# EAGLE design microcontroller-board (EAGLE 5.06)
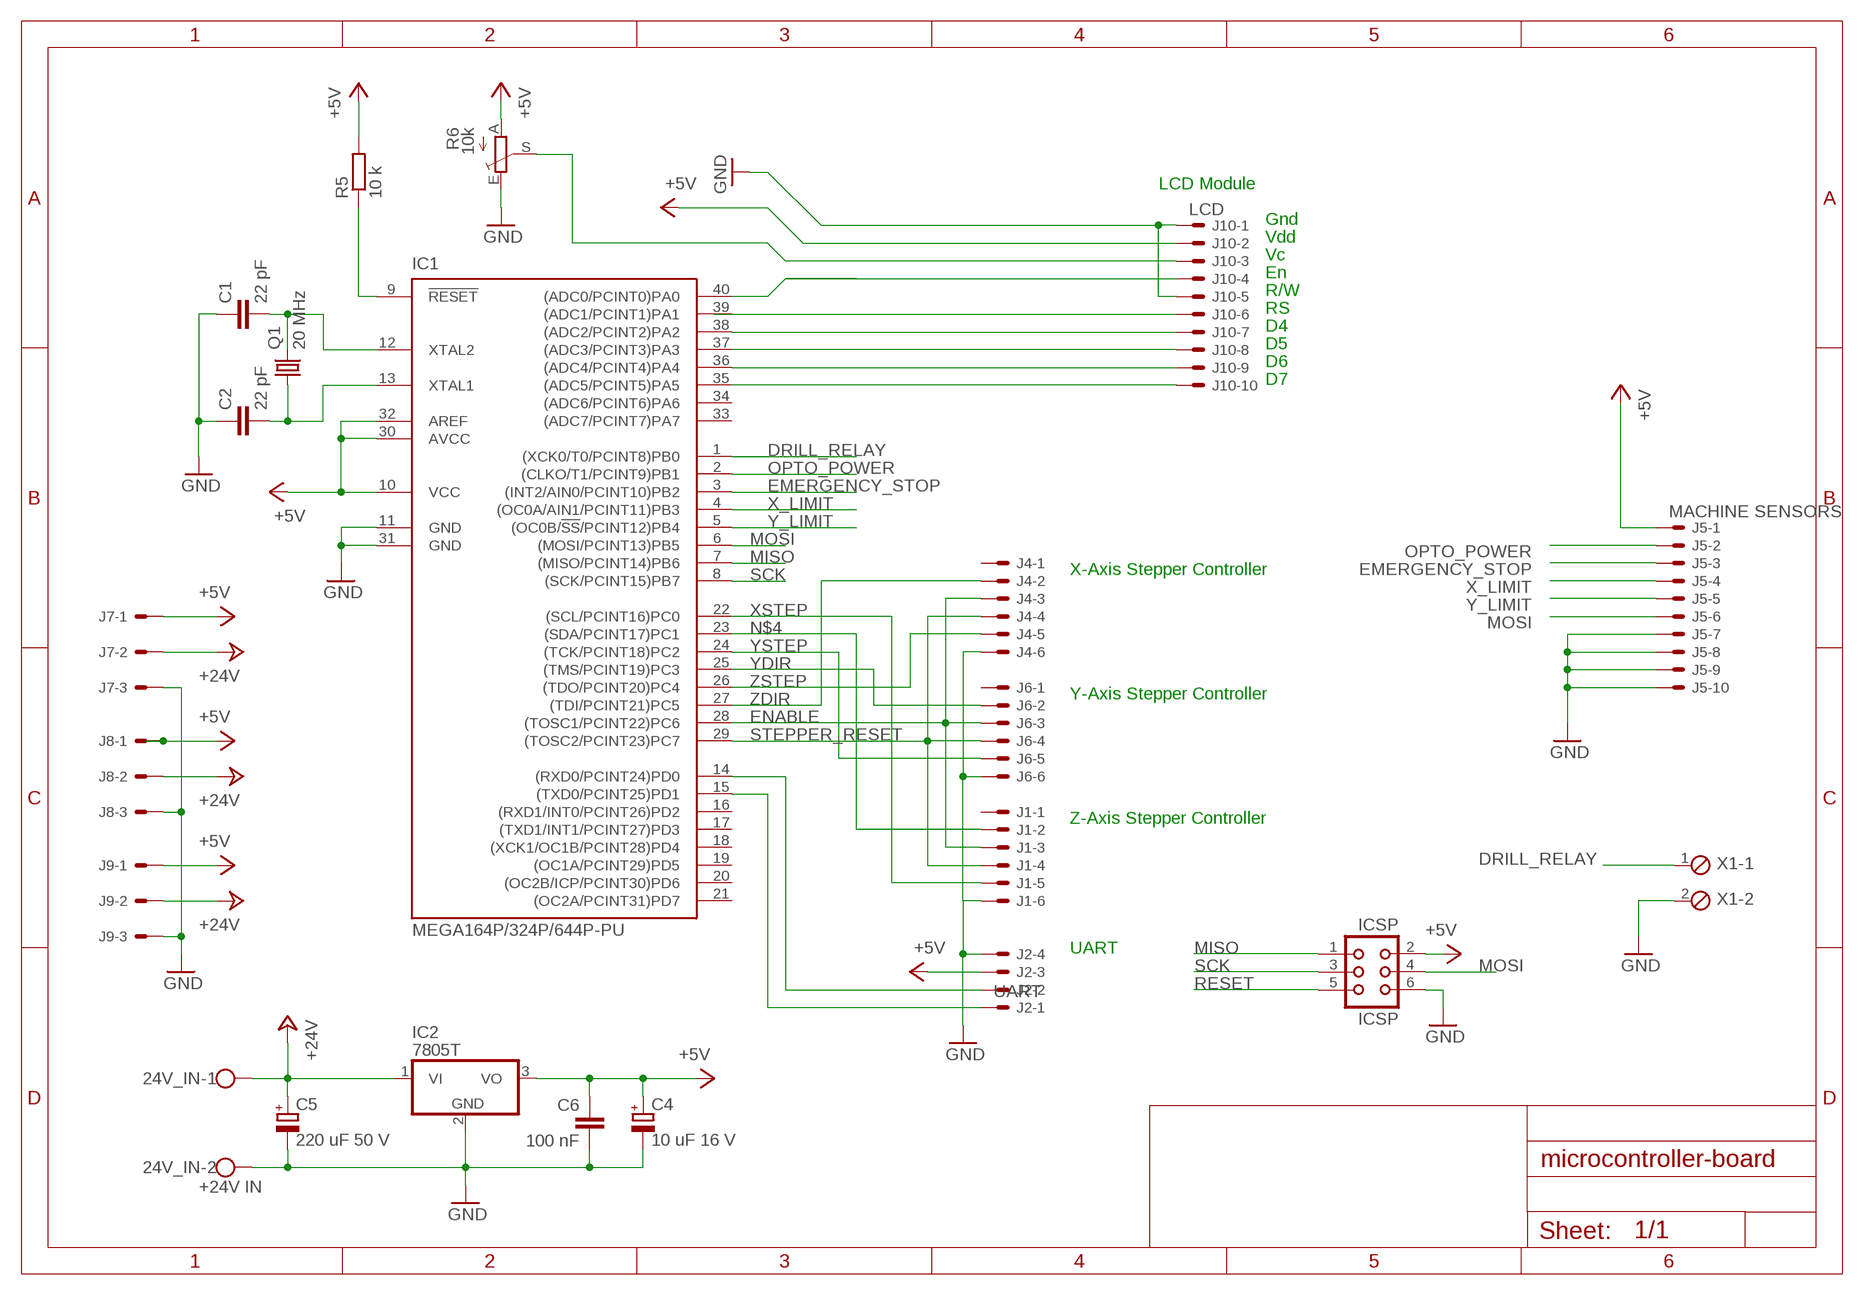
[diagram p0: schematic, sheet 1]

## Parts
24V_IN  +24V IN  W237-02P  [W237-132]
C1  22 pF  C-EU050-024X044  [C050-024X044]
C2  22 pF  C-EU050-024X044  [C050-024X044]
C4  10 uF 16 V  CPOL-EUE5-5  [E5-5]
C5  220 uF 50 V  CPOL-EUE5-8.5  [E5-8,5]
C6  100 nF  C-EU050-024X044  [C050-024X044]
IC1  MEGA164P/324P/644P-PU  [DIL40]
IC2  7805T  [TO220H]
ICSP  ICSP  CON06  [CON06]
J1  22-27-2061-06  [6410-06]
J2  UART  22-27-2041-04  [6410-04]
J4  22-27-2061-06  [6410-06]
J5  MACHINE SENSORS  22-27-2101-10  [6410-10]
J6  22-27-2061-06  [6410-06]
J7  22-27-2031-03  [6410-03]
J8  22-27-2031-03  [6410-03]
J9  22-27-2031-03  [6410-03]
J10  LCD  22-27-2101-10  [6410-10]
Q1  20 MHz  CRYSTALHC49U-V  [HC49U-V]
R5  10 k  R-EU_0207/10  [0207/10]
R6  10k  TRIM_EU-RS3  [RS3]
X1  MPT2  [2POL254]

## Nets
+5V: C4.+ C6.1 IC1.10(VCC) IC1.30(AVCC) IC1.32(AREF) IC2.3(VO) ICSP.2 J2.3 J5.1 J7.1 J8.1 J9.1 J10.2 R5.2 R6.A
+24V: 24V_IN.1 C5.+ IC2.1(VI) J7.2 J8.2 J9.2
DRILL_RELAY: IC1.1((XCK0/T0/PCINT8)PB0) X1.1
EMERGENCY_STOP: IC1.3((INT2/AIN0/PCINT10)PB2) J5.3
ENABLE: IC1.28((TOSC1/PCINT22)PC6) J1.3 J4.3 J6.3
GND: 24V_IN.2 C1.1 C2.1 C4.- C5.- C6.2 IC1.11(GND) IC1.31(GND) IC2.2(GND) ICSP.6 J1.6 J2.4 J4.6 J5.7 J5.8 J5.9 J5.10 J6.6 J7.3 J8.3 J9.3 J10.1 J10.5 R6.E X1.2
MISO: IC1.7((MISO/PCINT14)PB6) ICSP.1
MOSI: IC1.6((MOSI/PCINT13)PB5) ICSP.4 J5.6
N$1: C1.2 IC1.12(XTAL2) Q1.2
N$2: C2.2 IC1.13(XTAL1) Q1.1
N$4: IC1.23((SDA/PCINT17)PC1) J1.2
N$5: IC1.39((ADC1/PCINT1)PA1) J10.6
N$6: IC1.35((ADC5/PCINT5)PA5) J10.10
N$7: J10.3 R6.S
N$12: IC1.36((ADC4/PCINT4)PA4) J10.9
N$13: IC1.37((ADC3/PCINT3)PA3) J10.8
N$14: IC1.38((ADC2/PCINT2)PA2) J10.7
N$17: IC1.15((TXD0/PCINT25)PD1) J2.1
N$18: IC1.14((RXD0/PCINT24)PD0) J2.2
N$31: IC1.40((ADC0/PCINT0)PA0) J10.4
OPTO_POWER: IC1.2((CLKO/T1/PCINT9)PB1) J5.2
RESET: IC1.9(!RESET) ICSP.5 R5.1
SCK: IC1.8((SCK/PCINT15)PB7) ICSP.3
STEPPER_RESET: IC1.29((TOSC2/PCINT23)PC7) J1.4 J4.4 J6.4
X_LIMIT: IC1.4((OC0A/AIN1/PCINT11)PB3) J5.4
XSTEP: IC1.22((SCL/PCINT16)PC0) J1.5
Y_LIMIT: IC1.5((OC0B/!SS!/PCINT12)PB4) J5.5
YDIR: IC1.25((TMS/PCINT19)PC3) J6.2
YSTEP: IC1.24((TCK/PCINT18)PC2) J6.5
ZDIR: IC1.27((TDI/PCINT21)PC5) J4.2
ZSTEP: IC1.26((TDO/PCINT20)PC4) J4.5
Unconnected: IC1.16((RXD1/INT0/PCINT26)PD2) IC1.17((TXD1/INT1/PCINT27)PD3) IC1.18((XCK1/OC1B/PCINT28)PD4) IC1.19((OC1A/PCINT29)PD5) IC1.20((OC2B/ICP/PCINT30)PD6) IC1.21((OC2A/PCINT31)PD7) IC1.33((ADC7/PCINT7)PA7) IC1.34((ADC6/PCINT6)PA6) J1.1 J4.1 J6.1

## Notes on the sheet
- LCD Module
- Gnd
- Vdd
- Vc
- En
- R/W
- RS
- D4
- D5
- D6
- D7
- X-Axis Stepper Controller
- Y-Axis Stepper Controller
- Z-Axis Stepper Controller
- UART

## Library data of the parts
24V_IN = con-wago-508:W237-02P: WAGO SREW CLAMP
C1 C2 C6 = rcl:C-EU: CAPACITOR, European symbol
C4 C5 = rcl:CPOL-EU: POLARIZED CAPACITOR, European symbol
IC1 = avr-5:MEGA164P/324P/644P-PU
IC2 = linear:78*: Positive VOLTAGE REGULATOR Source: http://cache.national.com/ds/LM/LM78L05.pdf http://www.fairchildsemi.com/ds/LM/LM7805.pdf
ICSP = con-harting:CON06: CONNECTOR
J1 J4 J6 = con-molex:22-?-06: CONNECTOR wire to board 2.54 mm (.1 inch) pitch header
J2 = con-molex:22-?-04: CONNECTOR wire to board 2.54 mm (.1 inch) pitch header
J5 J10 = con-molex:22-?-10: CONNECTOR wire to board 2.54 mm (.1 inch) pitch header
J7-J9 = con-molex:22-?-03: CONNECTOR wire to board 2.54 mm (.1 inch) pitch header
Q1 = crystal:CRYSTAL: CRYSTAL
R5 = rcl:R-EU_: RESISTOR, European symbol
R6 = pot:TRIM_EU-: POTENTIOMETER
X1 = con-phoenix-254:MPT2: PHOENIX CONNECTOR

## Board
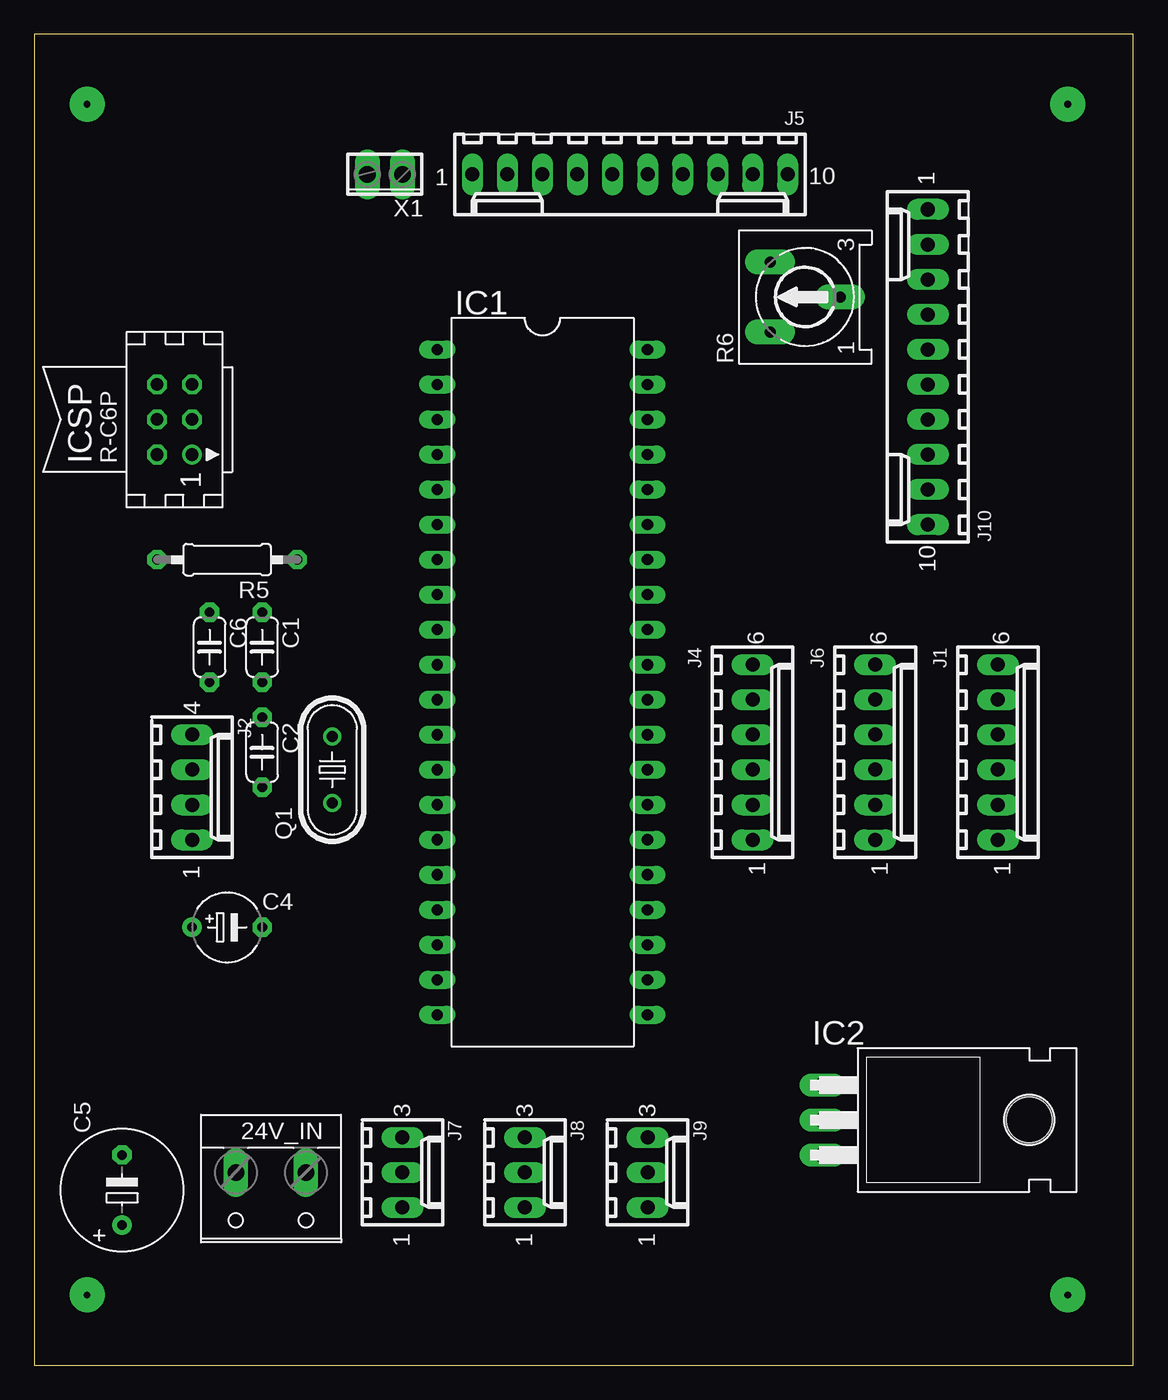
[diagram p1: board, top side]
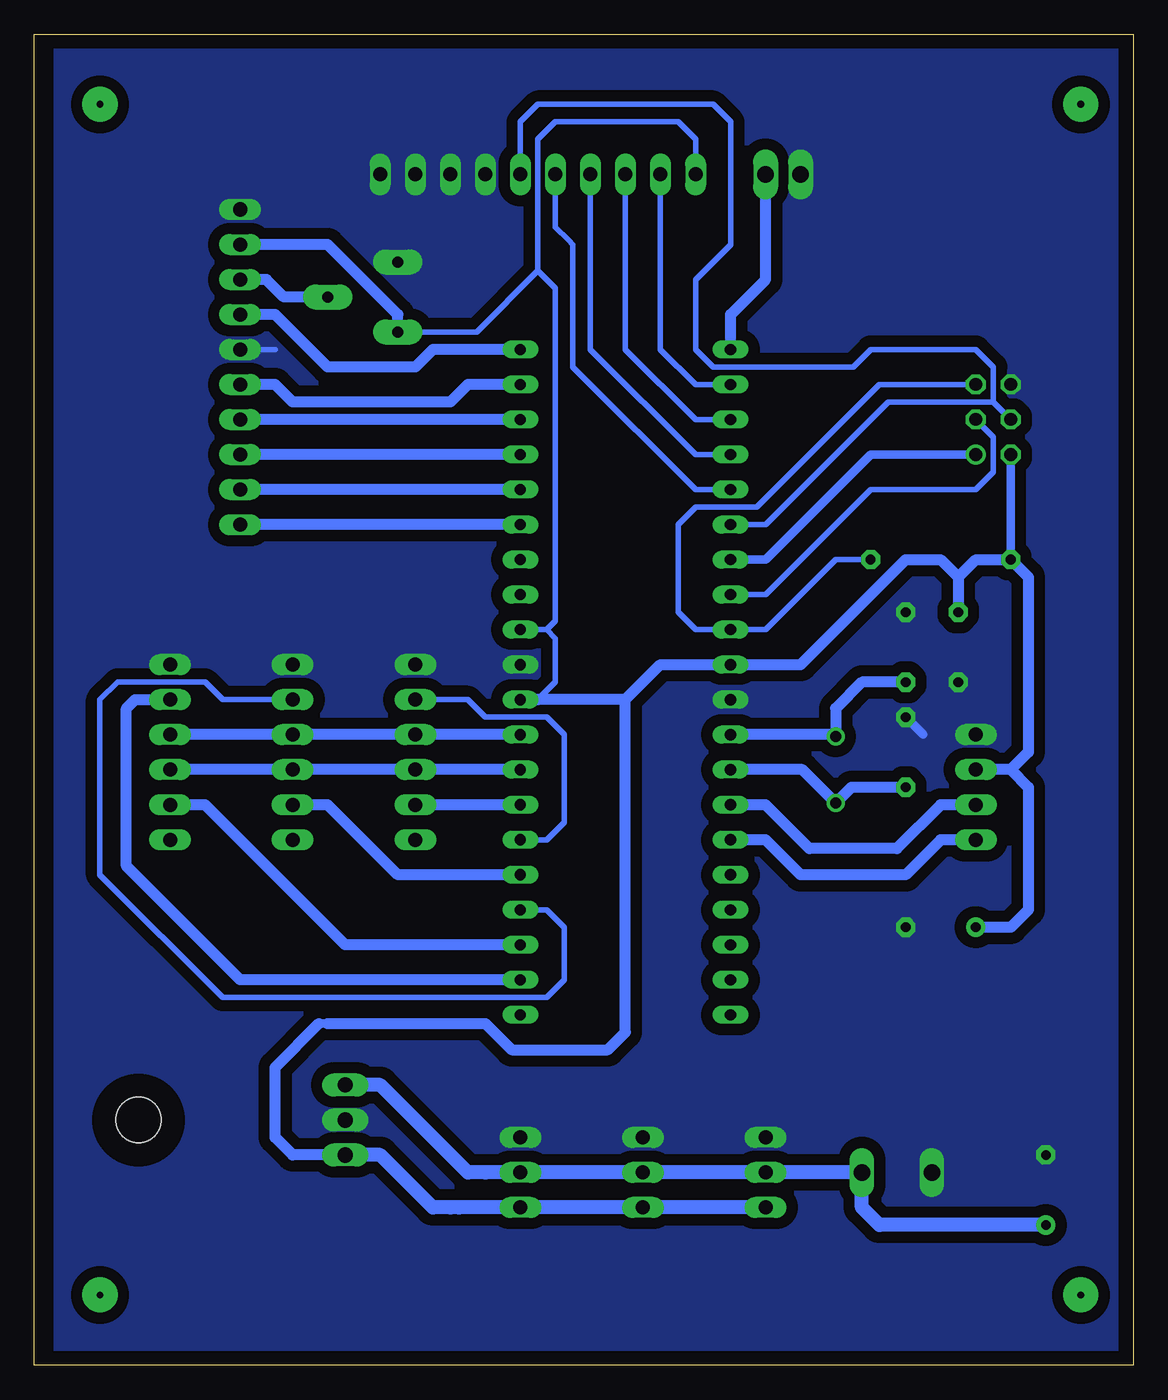
[diagram p2: board, bottom side, seen from below]

Size 79.68 x 96.51 mm. Coordinates in mm from the lower left corner, seen from the top.
Outline: 0,0 79.68,0 79.68,96.51 0,96.51 0,0
Copper layers (1*16): Top 0.035mm / dielectric 1.5mm / Bottom 0.035mm
Design rules "default": minimum track width 10mil, minimum drill 24mil, track to track 8mil, track to pad 8mil, pad to pad 8mil, via to via 8mil, smd to smd 8mil, copper to edge 40mil, drill to drill 8mil, minimum pad ring 10mil, minimum via ring 8mil, stop-mask expansion 4mil, vias tented up to drill 0mil, thermal gap 10mil

### Footprints (pad centres in the part's own frame; a part is rotated, then mirrored left to right if it is on the bottom)
W237-132 = drill 1.194 long: 1 -2.54,-0.635; 2 2.54,-0.635
C050-024X044 = drill 0.7 pad 1.4 octagon: 1 -2.54,0; 2 2.54,0
E5-5 = drill 0.7 pad 1.4 round: + -2.54,0 | drill 0.7 pad 1.4 octagon: - 2.54,0
E5-8,5 = drill 0.7 pad 1.4 round: + -2.54,0 | drill 0.7 pad 1.4 octagon: - 2.54,0
DIL40 = drill 0.813 long: 1 -24.13,-7.62; 2 -21.59,-7.62; 3 -19.05,-7.62; 4 -16.51,-7.62; 5 -13.97,-7.62; 6 -11.43,-7.62; 7 -8.89,-7.62; 8 -6.35,-7.62; 9 -3.81,-7.62; 10 -1.27,-7.62; 11 1.27,-7.62; 12 3.81,-7.62; 13 6.35,-7.62; 14 8.89,-7.62; 15 11.43,-7.62; 16 13.97,-7.62; 17 16.51,-7.62; 18 19.05,-7.62; 19 21.59,-7.62; 20 24.13,-7.62; 21 24.13,7.62; 22 21.59,7.62; 23 19.05,7.62; 24 16.51,7.62; 25 13.97,7.62; 26 11.43,7.62; 27 8.89,7.62; 28 6.35,7.62; 29 3.81,7.62; 30 1.27,7.62; 31 -1.27,7.62; 32 -3.81,7.62; 33 -6.35,7.62; 34 -8.89,7.62; 35 -11.43,7.62; 36 -13.97,7.62; 37 -16.51,7.62; 38 -19.05,7.62; 39 -21.59,7.62; 40 -24.13,7.62
TO220H = drill 1.118 long: 1 -2.54,-10.16; 2 0,-10.16; 3 2.54,-10.16 | hole 3.302: 0,4.826
CON06 = drill 0.914 round: 1 -2.54,-1.27 | drill 0.914 octagon: 2 -2.54,1.27; 3 0,-1.27; 4 0,1.27; 5 2.54,-1.27; 6 2.54,1.27
6410-06 = drill 1.016 long: 1 6.35,0; 2 3.81,0; 3 1.27,0; 4 -1.27,0; 5 -3.81,0; 6 -6.35,0
6410-04 = drill 1.016 long: 1 3.81,0; 2 1.27,0; 3 -1.27,0; 4 -3.81,0
6410-10 = drill 1.016 long: 1 11.43,0; 2 8.89,0; 3 6.35,0; 4 3.81,0; 5 1.27,0; 6 -1.27,0; 7 -3.81,0; 8 -6.35,0; 9 -8.89,0; 10 -11.43,0
6410-03 = drill 1.016 long: 1 2.54,0; 2 0,0; 3 -2.54,0
HC49U-V = drill 0.813 round: 1 -2.413,0; 2 2.413,0
0207/10 = drill 0.7 pad 1.4 octagon: 1 -5.08,0; 2 5.08,0
RS3 = drill 0.8 pad 1.8 long: A -2.54,2.54; E 2.54,2.54; S 0,-2.54
2POL254 = drill 1.2 long: 1 -1.27,0; 2 1.27,0

### Placement (x,y rotation side)
24V_IN  17.14,13.34 180 top
C1  16.51,52.07 270 top
C2  16.51,44.45 270 top
C4  13.97,31.75 0 top
C5  6.35,12.7 90 top
C6  12.7,52.07 270 top
IC1  36.83,49.53 270 top
IC2  67.31,17.78 270 top
ICSP  10.16,68.58 90 top
J1  69.85,44.45 270 top
J2  11.43,41.91 270 top
J4  52.07,44.45 270 top
J5  43.18,86.36 180 top
J6  60.96,44.45 270 top
J7  26.67,13.97 270 top
J8  35.56,13.97 270 top
J9  44.45,13.97 270 top
J10  64.77,72.39 90 top
Q1  21.59,43.18 90 top
R5  13.97,58.42 180 top
R6  55.88,77.47 90 top
X1  25.4,86.36 180 top

### Tracks (layer width: path | path; a pad name or v marks a point on that pad's centre or on a via)
+5V
  Bottom 0.406: J5.1 31.75,88.9 33.02,90.17 41.91,90.17 43.18,88.9 43.18,79.38 | R6.A 47.62,74.93 43.18,79.38 | 43.18,79.38 41.91,78.1 41.91,66.67 | 41.91,66.67 41.91,66.04 | 42.55,53.34 41.91,53.97 41.91,66.67 | 42.55,53.34 IC1.32 | 42.55,53.34 41.91,52.7 41.91,49.53 43.18,48.26
  Bottom 0.61: J8.1 J9.1 | 59.05,24.77 58.42,24.77 | R5.2 ICSP.2
  Bottom 0.813: 8.89,43.18 7.62,44.45 7.62,57.15 R5.2 11.43,58.42 12.7,57.15 | 8.89,43.18 J2.3 | 36.83,48.26 43.18,48.26 IC1.30 | 36.83,48.26 36.83,24.13 38.1,22.86 45.09,22.86 46.99,24.77 58.42,24.77 | 36.83,48.26 34.29,50.8 IC1.10 24.13,50.8 16.51,58.42 13.97,58.42 12.7,57.15 | 59.05,24.77 62.23,21.59 62.23,16.51 60.96,15.24 IC2.3 | 12.7,57.15 C6.1 | C4.+ 8.89,31.75 7.62,33.02 7.62,41.91 8.89,43.18 | J10.2 58.42,81.28 53.34,76.2 R6.A
  Bottom 1.016: J7.1 J8.1 J9.1 48.89,11.43 | 48.89,11.43 49.53,11.43 | 48.89,11.43 50.8,11.43 54.61,15.24 IC2.3
+24V
  Bottom 0.813: J8.2 37.46,13.97
  Bottom 1.016: C5.+ 18.41,10.16 19.68,11.43 24V_IN.1 J7.2 J8.2 J9.2 46.99,13.97 48.26,13.97 54.61,20.32 IC2.1
DRILL_RELAY
  Bottom 0.813: X1.1 26.67,78.74 29.21,76.2 IC1.1
EMERGENCY_STOP
  Bottom 0.406: J5.3 36.83,73.66 31.75,68.58 IC1.3
ENABLE
  Bottom 0.813: IC1.28 J4.3 J6.3 J1.3
GND
  Bottom 0.406: 62.23,73.66 J10.5
  Bottom 0.61: 15.24,45.72 C2.1
  pour Bottom (isolate 0.813, no thermals): 78.11,0 1.27,0 1.27,97.16 78.11,97.16
MISO
  Bottom 0.61: ICSP.1 19.05,66.04 26.67,58.42 IC1.7
MOSI
  Bottom 0.406: ICSP.4 10.16,69.85 | IC1.6 26.67,60.96 17.78,69.85 10.16,69.85 | 10.16,69.85 10.16,72.39 11.43,73.66 19.05,73.66 20.32,72.39 30.48,72.39 31.75,73.66 31.75,78.74 29.21,81.28 29.21,90.17 30.48,91.44 43.18,91.44 44.45,90.17 J5.6
N$1
  Bottom 0.61: Q1.2 21.59,45.72
  Bottom 0.813: 21.59,45.72 IC1.12 | Q1.2 21.59,47.62 19.68,49.53 C1.2
N$2
  Bottom 0.813: IC1.13 24,43.18 Q1.1 20.45,41.91 C2.2
N$3  (via drill 0.5 pad 2.54)
  other vias: 74.93,91.44
N$4
  Bottom 0.813: IC1.23 57.15,30.48 67.31,40.64 J1.2
N$5
  Bottom 0.813: IC1.39 48.26,71.12 49.53,69.85 60.96,69.85 62.23,71.12 J10.6
N$6
  Bottom 0.813: IC1.35 J10.10
N$7
  Bottom 0.813: J10.3 62.86,78.74 61.59,77.47 R6.S
N$8  (via drill 0.5 pad 2.54)
  other vias: 3.81,91.44
N$9  (via drill 0.5 pad 2.54)
  other vias: 3.81,5.08
N$10  (via drill 0.5 pad 2.54)
  other vias: 74.93,5.08
N$12
  Bottom 0.813: IC1.36 J10.9
N$13
  Bottom 0.813: IC1.37 J10.8
N$14
  Bottom 0.813: IC1.38 J10.7
N$17
  Bottom 0.813: J2.1 13.97,38.1 16.51,35.56 24.13,35.56 26.67,38.1 IC1.15
N$18
  Bottom 0.813: J2.2 13.97,40.64 17.14,37.47 23.49,37.47 26.67,40.64 IC1.14
N$31
  Bottom 0.813: IC1.40 50.8,73.66 52.07,72.39 58.42,72.39 62.23,76.2 J10.4
OPTO_POWER
  Bottom 0.406: J5.2 34.29,73.66 31.75,71.12 IC1.2
RESET
  Bottom 0.406: ICSP.5 18.41,71.12 27.3,62.23 31.75,62.23 33.02,60.96 33.02,54.61 31.75,53.34 IC1.9 26.67,53.34 21.59,58.42 R5.1
SCK
  Bottom 0.406: IC1.8 26.67,55.88 19.05,63.5 11.43,63.5 10.16,64.77 10.16,67.31 ICSP.3
STEPPER_RESET
  Bottom 0.813: IC1.29 J4.4 J6.4 J1.4
X_LIMIT
  Bottom 0.406: J5.4 39.37,73.66 31.75,66.04 IC1.4
XSTEP
  Bottom 0.813: J1.5 72.39,48.26 73.03,47.62 73.03,36.2 64.77,27.94 IC1.22
Y_LIMIT
  Bottom 0.406: IC1.5 31.75,63.5 40.32,72.07 40.64,72.39 40.64,81.28 40.96,81.6 41.91,82.55 J5.5
YDIR
  Bottom 0.813: IC1.25 53.34,35.56 58.42,40.64 J6.2
YSTEP
  Bottom 0.406: J6.5 66.04,48.26 67.31,49.53 73.66,49.53 74.93,48.26 74.93,35.56 66.04,26.67 42.55,26.67 41.27,27.94 41.27,31.75 42.55,33.02 IC1.24
ZDIR
  Bottom 0.813: IC1.27 J4.2
ZSTEP
  Bottom 0.406: J4.5 48.26,48.26 46.99,46.99 42.55,46.99 41.27,45.72 41.27,39.37 42.55,38.1 IC1.26

### Text on the board
tNames: SOLID STATE RELAY - CAUTION 240VAC